# Altium project keyMANDevices.PrjPCB
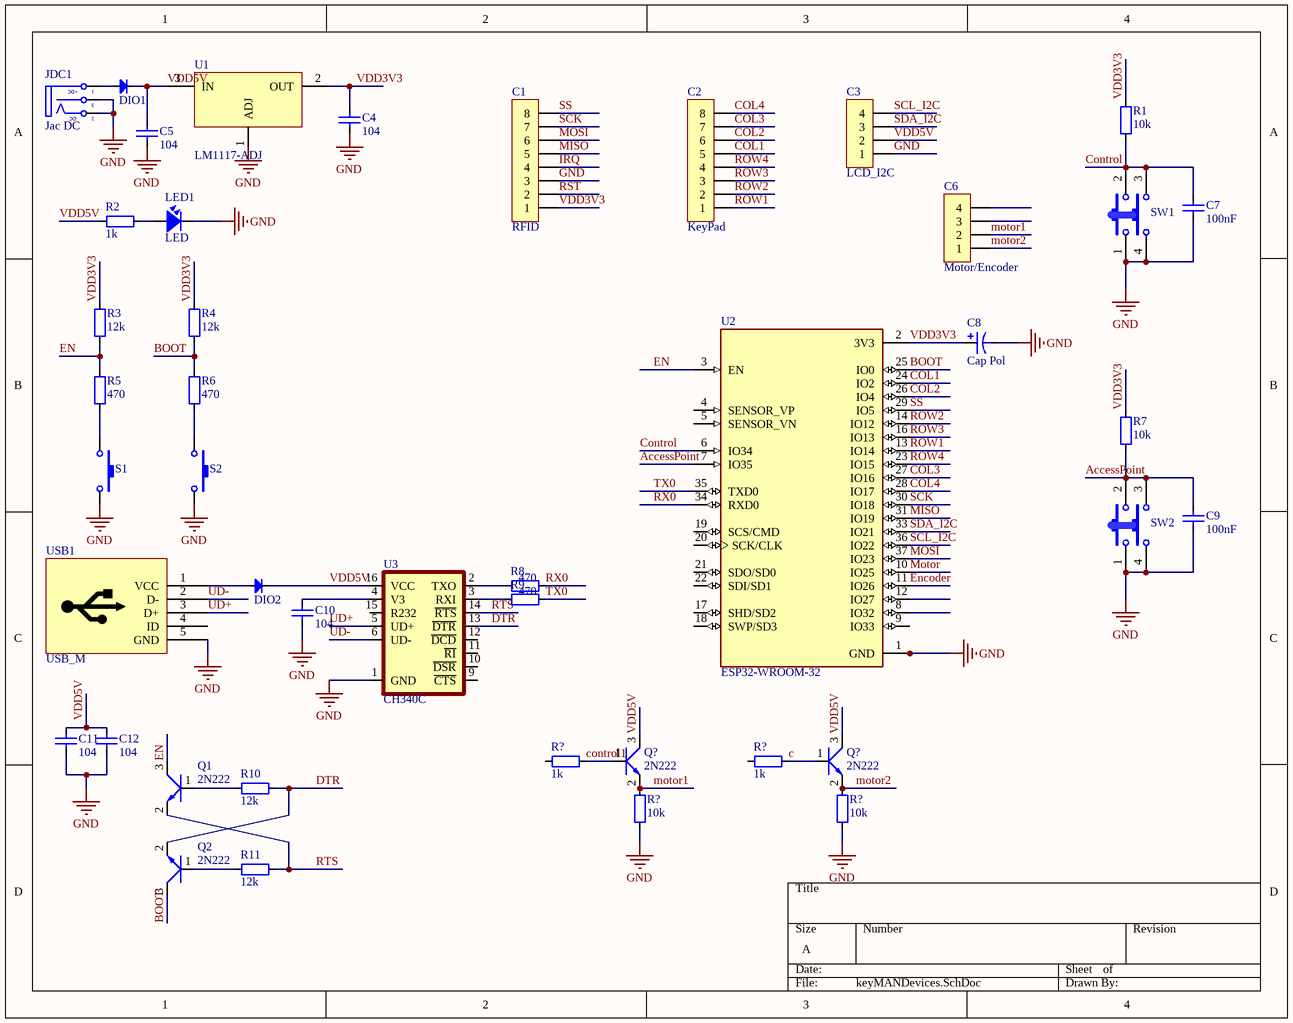
[diagram p0: keyMANDevices.SchDoc]
1 sheet, 43 parts. Net scope: global (net labels, ports and power ports of the same name join across sheets).
Board file: keyMANDevices.PcbDoc

## Sheet keyMANDevices.SchDoc
size A

### Parts
(Parts that share a designator on the sheet are numbered #1, #2 ... from top to bottom, then left to right.)
C1  RFID  [J8-C1T]
C2  KeyPad  [J8-C1T]
C3  LCD_I2C  [J4-D1T]
C4  104  [CAP_0805]
C5  104  [CAP_0805]
C6  Motor/Encoder  [J4-D1T]
C7  100nF  [CAP_0402]
C8  Cap Pol  [C3MM]
C9  100nF  [CAP_0402]
C10  104  [CAP_0402]
C11  104  [CAP_0402]
C12  104  [CAP_0805]
DIO1  Diode SMD  [DIO-SMD-123]  (value not drawn)
DIO2  Diode SMD  [DIO-SMD-123]  (value not drawn)
JDC1  Jac DC  [DC-IN]
LED1  LED  [LED-0805-Red]
Q1  2N222  [SOT23D]
Q2  2N222  [SOT23D]
Q?#1  2N222  [SOT23D]
Q?#2  2N222  [SOT23D]
R1  10k  [RES-SMD-0805]
R2  1k  [RES-SMD-0805]
R3  12k  [RES-SMD-0805]
R4  12k  [RES-SMD-0805]
R5  470  [RES-SMD-0805]
R6  470  [RES-SMD-0805]
R7  10k  [RES-SMD-0805]
R8  470  [RES-SMD-0805]
R9  470  [RES-SMD-0805]
R10  12k  [RES-SMD-0805]
R11  12k  [RES-SMD-0805]
R?#1  1k  [RES-SMD-0805]
R?#2  1k  [RES-SMD-0805]
R?#3  10k  [RES-SMD-0805]
R?#4  10k  [RES-SMD-0805]
S1  SW-SMD  [SW 3x2x4]  (value not drawn)
S2  SW-SMD  [SW 3x2x4]  (value not drawn)
SW1  SW-4P-S  [SW-4P-S]  (value not drawn)
SW2  SW-4P-S  [SW-4P-S]  (value not drawn)
U1  LM1117-ADJ  [LM1117-SOP]
U2  ESP32-WROOM-32  [MODULE_ESP32-WROOM-32]
U3  CH340C  [SO016]
USB1  USB_M  [USB_B_MINI_SMD]

### Nets
GND: C1.3 C3.1 C4.1 C5.1 C7.1 C8.2 C9.1 C10.1 C11.1 C12.1 JDC1.2(TN) JDC1.3(S) LED1.2 R?#3.1 R?#4.1 S1.2 S2.2 SW1.1 SW1.4 SW2.1 SW2.4 U1.1(ADJ) U2.1(GND) U2.15(GND) U2.38(GND) U2.39_1(GND) U2.39_2(GND) U2.39_3(GND) U2.39_4(GND) U2.39_5(GND) U2.39_6(GND) U2.39_7(GND) U2.39_8(GND) U2.39_9(GND) U2.39_10(GND) U2.39_11(GND) U2.39_12(GND) U2.39_13(GND) U2.39_14(GND) U2.39_15(GND) U2.39_16(GND) U2.39_17(GND) U2.39_18(GND) U2.39_19(GND) U2.39_20(GND) U2.39_21(GND) U3.1(GND) USB1.5(GND)
AccessPoint: C9.2 R7.2 SW2.2 SW2.3 U2.7(IO35)
BOOT: Q2.3(C) R4.1 R6.2 U2.25(IO0)
c: Q?#2.1(B) R?#2.2
COL1: C2.5 U2.24(IO2)
COL2: C2.6 U2.26(IO4)
COL3: C2.7 U2.27(IO16)
COL4: C2.8 U2.28(IO17)
Control: C7.2 R1.2 SW1.2 SW1.3 U2.6(IO34)
control1: Q?#1.1(B) R?#1.2
DTR: Q2.2(E) R10.2 U3.13(~{DTR})
EN: Q1.3(C) R3.1 R5.2 U2.3(EN)
Encoder: U2.11(IO26)
IRQ: C1.4
MISO: C1.5 U2.31(IO19)
MOSI: C1.6 U2.37(IO23)
Motor: U2.10(IO25)
motor1: C6.2 Q?#1.2(E) R?#3.2
motor2: C6.1 Q?#2.2(E) R?#4.2
ROW1: C2.1 U2.13(IO14)
ROW2: C2.2 U2.14(IO12)
ROW3: C2.3 U2.16(IO13)
ROW4: C2.4 U2.23(IO15)
RST: C1.2
RTS: Q1.2(E) R11.2 U3.14(~{RTS})
RX0: R8.2 U2.34(RXD0)
SCK: C1.7 U2.30(IO18)
SCL_I2C: C3.4 U2.36(IO22)
SDA_I2C: C3.3 U2.33(IO21)
SS: C1.8 U2.29(IO5)
TX0: R9.2 U2.35(TXD0)
UD+: U3.5(UD+) USB1.3(D+)
UD-: U3.6(UD-) USB1.2(D-)
VDD3V3: C1.1 C4.2 C8.1 R1.1 R3.2 R4.2 R7.1 U1.2(OUT) U2.2(3V3)
VDD5V: C3.2 C5.2 C11.2 C12.2 DIO1.2(K) DIO2.2(K) Q?#1.3(C) Q?#2.3(C) R2.1 U1.3(IN) U3.16(VCC)
NetC10_2: C10.2 U3.4(V3)
NetDIO1_1: DIO1.1(A) JDC1.1(T)
NetDIO2_1: DIO2.1(A) USB1.1(VCC)
NetLED1_1: LED1.1 R2.2
NetQ1_1: Q1.1(B) R10.1
NetQ2_1: Q2.1(B) R11.1
NetR5_1: R5.1 S1.1
NetR6_1: R6.1 S2.1
NetR8_1: R8.1 U3.2(TXO)
NetR9_1: R9.1 U3.3(RXI)

Not connected (* = marked no-connect by the designer): C6 3 4; R?#1 1; R?#2 1; U2 4(SENSOR_VP) 5(SENSOR_VN) 8(IO32) 9(IO33) 12(IO27) 17(SHD/SD2) 18(SWP/SD3) 19(SCS/CMD) 20(SCK/CLK) 21(SDO/SD0) 22(SDI/SD1); U3 9(~{CTS}) 10(~{DSR}) 11(~{RI}) 12(~{DCD}) 15(R232); USB1 4(ID)

### Notes on the sheet
- (in symbol DCIN) +DC; -DC

### Library data of the parts
C1 C2 = JP8x1-2.0: WR-PHD 2.00 mm Socket Header; Manufacturer: W¨¹rth Elektronik eiSos GmbH; partNo: 62000811821; ComponentLink1 Description: Manufacturer; ComponentLink2 Description: Datasheet; NoPins: 08; Created Date: 2 April 2013; ComponentLink1URL: http://www.we-online.com; ComponentLink2URL: http://katalog.we-online.de/em/datasheet/6200xx11821.pdf; Created by: Karrer Zheng
C3 C6 = JP4x1-2.0: WR-PHD 2.00 mm Socket Header; Manufacturer: W¨¹rth Elektronik eiSos GmbH; partNo: 62000411821; ComponentLink1 Description: Manufacturer; ComponentLink2 Description: Datasheet; NoPins: 04; Created Date: 2 April 2013; ComponentLink1URL: http://www.we-online.com; ComponentLink2URL: http://katalog.we-online.de/em/datasheet/6200xx11821.pdf; Created by: Karrer Zheng
C4 C5 C7 C9-C12 = CapSMD: Capacitor; Value: 33p; Published: 8-Jun-2000; LatestRevisionDate: 17-Jul-2002; LatestRevisionNote: Re-released for DXP Platform.; PackageReference: RAD-0.3; Publisher: Altium Limited
C8 = Cap Pol: Polarized Capacitor (Axial); Published: 8-Jun-2000; LatestRevisionDate: 17-Jul-2002; LatestRevisionNote: Re-released for DXP Platform.; PackageReference: POLAR0.8; Publisher: Altium Limited
DIO1 DIO2 = Diode SMD: Default Diode; Code - JEDEC: DO-214-AB; Value: 1N5007; Published: 8-Jun-2000; Revision: July-2002: Re-released for DXP Platform.; Publisher: Altium Limited
JDC1 = DCIN: Jac DC input; Value: Jac DC
LED1 = LED: LED Single colour Green and Red; Value: LED 3 ly Single Colour
Q1 Q2 Q?#1 Q?#2 = 2N222: NPN 600mW, ECB; Value: C1815
R1-R11 R?#1-R?#4 = Resistor - SMD: Resistor; Manufacturer: Generic Components; Class: Passive; Published: 08/06/2000; Publisher: Altium Hobart Technology Centre
S1 S2 = SW-SMD: Switch; Published: 24-Mar-1999; LatestRevisionDate: 17-Jul-2002; LatestRevisionNote: Re-released for DXP Platform.; PackageReference: SPST-2; Publisher: Altium Limited
SW1 SW2 = SW-4PIN-SMALL: Switch Small 4 Pin; Published: 24-Mar-1999; LatestRevisionDate: 17-Jul-2002; LatestRevisionNote: Re-released for DXP Platform.; PackageReference: SPST-2; Publisher: Altium Limited
U1 = LM1117-ADJ: 800mA Low-Dropout Linear Regulator; Creator: Nguyen Ba Bien; Website: http://group3i.net
U2 = ESP32-WROOM-32: Bluetooth, WiFi Transceiver Module 2.4GHz ~ 2.5GHz Surface Mount; MF: Espressif Systems; Package: Module Espressif Systems; Digi-Key_Part_Number: 1904-1010-1-ND; Digi-Key_Purchase_URL: https://www.digikey.com/product-detail/en/espressif-systems/ESP32-WROOM-32/1904-1010-1-ND/8544305?utm_source=snapeda&utm_medium=aggregator&utm_campaign=symbol; Value: *; MP: ESP32-WROOM-32; SnapEDA_Link: https://www.snapeda.com/parts/ESP32-WROOM-32/Espressif%20Systems/view-part/2753322/?ref=snap
U3 = CH340C: USB to serial chip CH340; MF: WCH; Package: Package; Check_prices: https://www.snapeda.com/parts/CH340C/WCH/view-part/5428851/?ref=eda; Value: *; Price: None; MP: CH340C; Availability: Unavailable; SnapEDA_Link: https://www.snapeda.com/parts/CH340C/WCH/view-part/5428851/?ref=snap